# EAGLE design FONA-Data-Logger-Board (EAGLE 7.5.0)
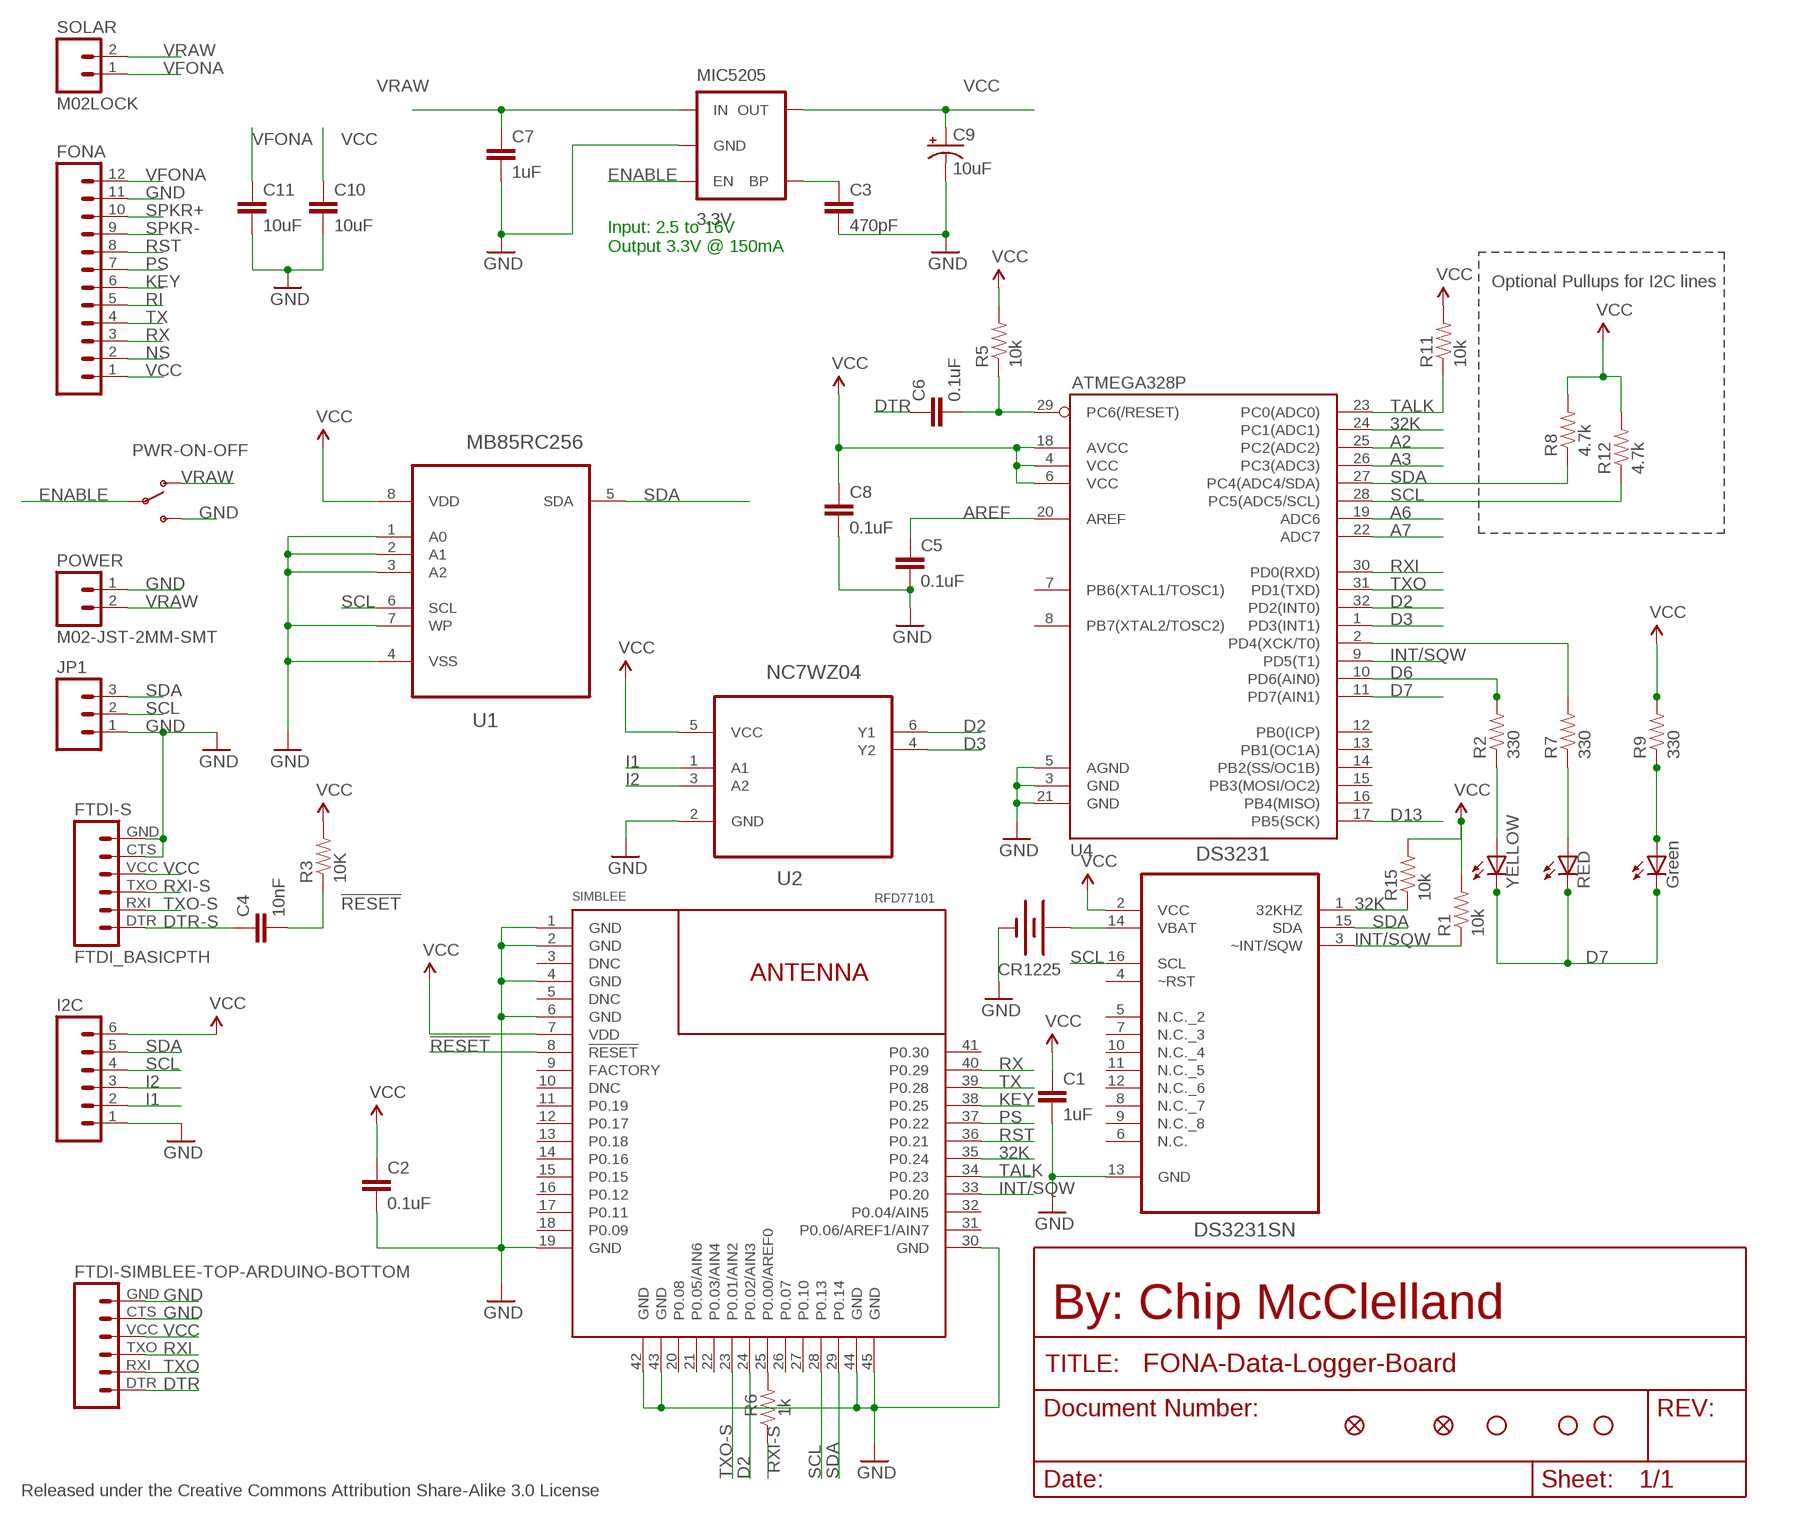
[diagram p0: schematic, sheet 1]

## Parts
ATMEGA328P  U4  ATMEGA168  [TQFP32-08]
C1  1uF  CAP0805  [0805]
C2  0.1uF  CAP0805  [0805]
C3  470pF  CAP0805  [0805]
C4  10nF  CAP0805  [0805]
C5  0.1uF  CAP0805  [0805]
C6  0.1uF  CAP0805  [0805]
C7  1uF  CAP0805  [0805]
C8  0.1uF  CAP0805  [0805]
C9  10uF  CAP_POL1206  [EIA3216]
C10  10uF  CAP0805  [0805]
C11  10uF  CAP0805  [0805]
CR1225  BATTERY12MM  [BATTCON_12MM]
DS3231  DS3231SN  [SOIC127P1032X265-16N]
FID1  FIDUCIALUFIDUCIAL  [MICRO-FIDUCIAL]
FID2  FIDUCIALUFIDUCIAL  [MICRO-FIDUCIAL]
FONA  M12PTH  [1X12]
FTDI-S  FTDI_BASICPTH  [FTDI_BASIC]
FTDI-SIMBLEE-TOP-ARDUINO-BOTTOM  FTDI Basic  FTDI_BASICPTH  [FTDI_BASIC]
G  Green  LEDCHIPLED_0805  [CHIPLED_0805]
I2C  M06LOCK  [1X06_LOCK]
JP1  M03LOCK  [1X03_LOCK]
JP3  STAND-OFF  [STAND-OFF]
JP4  STAND-OFF  [STAND-OFF]
JP6  STAND-OFF  [STAND-OFF]
MB85RC256  U1  MB85RC128PNF-G-JNE1  [SOIC127P600X175-8N]
MIC5205  3.3V  MIC52053.3V  [SOT23-5]
NC7WZ04  U2  NC7WZ04P6X  [SOT65P210X110-6N]
POWER  M02-JST-2MM-SMT  [JST-2-SMD]
PWR-ON-OFF  SWITCH-SPDTPTH  [SWITCH-SPDT]
R  RED  LEDCHIPLED_0805  [CHIPLED_0805]
R1  10k  RESISTOR0805-RES  [0805]
R2  330  RESISTOR0603  [0603-RES]
R3  10K  RESISTOR0805-RES  [0805]
R5  10k  RESISTOR0805-RES  [0805]
R6  1k  RESISTOR0805-RES  [0805]
R7  330  RESISTOR0603  [0603-RES]
R8  4.7k  RESISTOR0805-RES  [0805]
R9  330  RESISTOR0603  [0603-RES]
R11  10k  RESISTOR0805-RES  [0805]
R12  4.7k  RESISTOR0805-RES  [0805]
R15  10k  RESISTOR0805-RES  [0805]
SIMBLEE  RFD77101  [RFD77101]
SOLAR  M02LOCK  [1X02_LOCK]
Y  YELLOW  LEDCHIPLED_0805  [CHIPLED_0805]

## Nets
32K: ATMEGA328P.24(PC1(ADC1)) DS3231.1(32KHZ) R15.1 SIMBLEE.35(P0.24)
!RESET: C4.2 R3.1 SIMBLEE.8(!RESET!)
A2: ATMEGA328P.25(PC2(ADC2))
A3: ATMEGA328P.26(PC3(ADC3))
A6: ATMEGA328P.19(ADC6)
A7: ATMEGA328P.22(ADC7)
AREF: ATMEGA328P.20(AREF) C5.1
D2: ATMEGA328P.32(PD2(INT0)) NC7WZ04.6(Y1) SIMBLEE.24(P0.02/AIN3)
D3: ATMEGA328P.1(PD3(INT1)) NC7WZ04.4(Y2)
D6: ATMEGA328P.10(PD6(AIN0)) R2.2
D7: ATMEGA328P.11(PD7(AIN1)) G.C R.C Y.C
D13: ATMEGA328P.17(PB5(SCK))
DTR: C6.1 FTDI-SIMBLEE-TOP-ARDUINO-BOTTOM.DTR
DTR-S: C4.1 FTDI-S.DTR
ENABLE: MIC5205.3(EN) PWR-ON-OFF.2(P)
GND: ATMEGA328P.3(GND) ATMEGA328P.5(AGND) ATMEGA328P.21(GND) C1.2 C2.2 C3.2 C5.2 C7.2 C8.2 C9.C(-) C10.2 C11.2 CR1225.GND(-) DS3231.13(GND) FONA.11 FTDI-S.CTS FTDI-S.GND FTDI-SIMBLEE-TOP-ARDUINO-BOTTOM.CTS FTDI-SIMBLEE-TOP-ARDUINO-BOTTOM.GND I2C.1 JP1.1 MB85RC256.1(A0) MB85RC256.2(A1) MB85RC256.3(A2) MB85RC256.4(VSS) MB85RC256.7(WP) MIC5205.2(GND) NC7WZ04.2(GND) POWER.1 PWR-ON-OFF.3(S) SIMBLEE.1(GND) SIMBLEE.2(GND) SIMBLEE.4(GND) SIMBLEE.6(GND) SIMBLEE.19(GND) SIMBLEE.30(GND) SIMBLEE.42(GND) SIMBLEE.43(GND) SIMBLEE.44(GND) SIMBLEE.45(GND)
I1: I2C.2 NC7WZ04.1(A1)
I2: I2C.3 NC7WZ04.3(A2)
INT/SQW: ATMEGA328P.9(PD5(T1)) DS3231.3(~INT/SQW) R1.1 SIMBLEE.33(P0.20)
KEY: FONA.6 SIMBLEE.38(P0.25)
N$1: R2.1 Y.A
N$2: C3.1 MIC5205.4(BP)
N$3: ATMEGA328P.2(PD4(XCK/T0)) R7.2
N$4: R7.1 R.A
N$17: R6.2 SIMBLEE.25(P0.00/AREF0)
N$38: G.A R9.1
NS: FONA.2
PS: FONA.7 SIMBLEE.37(P0.22)
RESET: ATMEGA328P.29(PC6(/RESET)) C6.2 R5.1
RI: FONA.5
RST: FONA.8 SIMBLEE.36(P0.21)
RX: FONA.3 SIMBLEE.40(P0.29)
RXI: ATMEGA328P.30(PD0(RXD)) FTDI-SIMBLEE-TOP-ARDUINO-BOTTOM.TXO
RXI-S: FTDI-S.TXO R6.1
SCL: ATMEGA328P.28(PC5(ADC5/SCL)) DS3231.16(SCL) I2C.4 JP1.2 MB85RC256.6(SCL) R12.1 SIMBLEE.28(P0.13)
SDA: ATMEGA328P.27(PC4(ADC4/SDA)) DS3231.15(SDA) I2C.5 JP1.3 MB85RC256.5(SDA) R8.1 SIMBLEE.29(P0.14)
SPKR+: FONA.10
SPKR-: FONA.9
TALK: ATMEGA328P.23(PC0(ADC0)) R11.1 SIMBLEE.34(P0.23)
TX: FONA.4 SIMBLEE.39(P0.28)
TXO: ATMEGA328P.31(PD1(TXD)) FTDI-SIMBLEE-TOP-ARDUINO-BOTTOM.RXI
TXO-S: FTDI-S.RXI SIMBLEE.23(P0.01/AIN2)
VBAT: CR1225.PWR@1(+) DS3231.14(VBAT)
VCC: ATMEGA328P.4(VCC) ATMEGA328P.6(VCC) ATMEGA328P.18(AVCC) C1.1 C2.1 C8.1 C9.A(+) C10.1 DS3231.2(VCC) FONA.1 FTDI-S.VCC FTDI-SIMBLEE-TOP-ARDUINO-BOTTOM.VCC I2C.6 MB85RC256.8(VDD) MIC5205.5(OUT) NC7WZ04.5(VCC) R1.2 R3.2 R5.2 R8.2 R9.2 R11.2 R12.2 R15.2 SIMBLEE.7(VDD)
VFONA: C11.1 FONA.12 SOLAR.1
VRAW: C7.1 MIC5205.1(IN) POWER.2 PWR-ON-OFF.1(O) SOLAR.2
Unconnected: ATMEGA328P.7(PB6(XTAL1/TOSC1)) ATMEGA328P.8(PB7(XTAL2/TOSC2)) ATMEGA328P.12(PB0(ICP)) ATMEGA328P.13(PB1(OC1A)) ATMEGA328P.14(PB2(SS/OC1B)) ATMEGA328P.15(PB3(MOSI/OC2)) ATMEGA328P.16(PB4(MISO)) DS3231.4(~RST) DS3231.5(N.C._2) DS3231.6(N.C.) DS3231.7(N.C._3) DS3231.8(N.C._7) DS3231.9(N.C._8) DS3231.10(N.C._4) DS3231.11(N.C._5) DS3231.12(N.C._6) SIMBLEE.3(DNC) SIMBLEE.5(DNC) SIMBLEE.9(FACTORY) SIMBLEE.10(DNC) SIMBLEE.11(P0.19) SIMBLEE.12(P0.17) SIMBLEE.13(P0.18) SIMBLEE.14(P0.16) SIMBLEE.15(P0.15) SIMBLEE.16(P0.12) SIMBLEE.17(P0.11) SIMBLEE.18(P0.09) SIMBLEE.20(P0.08) SIMBLEE.21(P0.05/AIN6) SIMBLEE.22(P0.03/AIN4) SIMBLEE.26(P0.07) SIMBLEE.27(P0.10) SIMBLEE.31(P0.06/AREF1/AIN7) SIMBLEE.32(P0.04/AIN5) SIMBLEE.41(P0.30)

## Notes on the sheet
- Input: 2.5 to 16V
  Output 3.3V @ 150mA
- Optional Pullups for I2C lines
- By: Chip McClelland
- Released under the Creative Commons Attribution Share-Alike 3.0 License

## Library data of the parts
ATMEGA328P = SparkFun:ATMEGA168
C1 C2 C5 C6 C8 C10 C11 = SparkFun-Capacitors:CAP: Capacitor Standard 0603 ceramic capacitor, and 0.1" leaded capacitor.
C3 C4 C7 = SparkFun-Passives:CAP: Capacitor Standard 0603 ceramic capacitor, and 0.1" leaded capacitor.
C9 = SparkFun-Capacitors:CAP_POL: Capacitor Polarized These are standard SMD and PTH capacitors. Normally 10uF, 47uF, and 100uF in electrolytic and tantalum varieties. Always verify the external diameter of the through hole cap, it varies with capacity, voltage, and manufacturer. The EIA devices should be standard.
CR1225 = SparkFun-Electromechanical:BATTERY: Battery Holders Various common sizes : AA, AAA, 20mm coin cell and 12mm coin cell. 20MM_4LEGS, BATT-10373
DS3231 = Maxim_By_element14_Batch_1:DS3231SN: Extremely Accurate I2C-Integrated RTC/TCXO/Crystal; MPN: DS3231SN#; OC_FARNELL: 1593292; OC_NEWARK: 68K3406; PACKAGE: SOIC-16; SUPPLIER: Maxim
FID1 FID2 = SparkFun-Aesthetics:FIDUCIAL: Fiducial Alignment Points Various fiducial points for machine vision alignment.
FONA = SparkFun-Connectors:M12: Header 12 Standard 12-pin 0.1" header. Use with straight break away headers (SKU : PRT-00116), right angle break away headers (PRT-00553), swiss pins (PRT-00743), machine pins (PRT-00117), and female headers (PRT-00115).
FTDI-S FTDI-SIMBLEE-TOP-ARDUINO-BOTTOM = SparkFun-Connectors:FTDI_BASIC: FTDI Basic header with labels
G R Y = adafruit:LED: LED OSRAM: - CHIPLED LG R971, LG N971, LY N971, LG Q971, LY Q971, LO R971, LY R971 LH N974, LH R974 LS Q976, LO Q976, LY Q976 LO Q996 - Hyper CHIPLED LW Q18S LB Q993, LB Q99A, LB R99A - SideLED LS A670, LO A670, LY A670, LG A670, LP A670 LB A673, LV A673, LT A673, LW A673 LH A674 LY A675 LS A676, LA A676, LO A676, LY A676, LW A676 LS A679, LY A679, LG A679 - Hyper Micro SIDELED® LS Y876, LA Y876, LO Y876, LY Y876 LT Y87S - SmartLED LW L88C, LW L88S LB L89C, LB L89S, LG L890 LS L89K, LO L89K, LY L89K LS L896, LA L896, LO L896, LY L896 - TOPLED LS T670, LO T670, LY T670, LG T670, LP T670 LSG T670, LSP T670, LSY T670, LOP T670, LYG T670 LG T671, LOG T671, LSG T671 LB T673, LV T673, LT T673, LW T673 LH T674 LS T676, LA T676, LO T676, LY T676, LB T676, LH T676, LSB T676, LW T676 LB T67C, LV T67C, LT T67C, LS T67K, LO T67K, LY T67K, LW E67C LS E67B, LA E67B, LO E67B, LY E67B, LB E67C, LV E67C, LT E67C LW T67C LS T679, LY T679, LG T679 LS T770, LO T770, LY T770, LG T770, LP T770 LB T773, LV T773, LT T773, LW T773 LH T774 LS E675, LA E675, LY E675, LS T675 LS T776, LA T776, LO T776, LY T776, LB T776 LHGB T686 LT T68C, LB T68C - Hyper Mini TOPLED® LB M676 - Mini TOPLED Santana® LG M470 LS M47K, LO M47K, LY M47K Source: http://www.osram.convergy.de/
I2C = SparkFun-Connectors:M06: Header 6 Standard 6-pin 0.1" header. Use with straight break away headers (SKU : PRT-00116), right angle break away headers (PRT-00553), swiss pins (PRT-00743), machine pins (PRT-00117), and female headers (PRT-00115). Molex polarized connector foot print use with SKU : PRT-08094 with associated crimp pins and housings. NOTES ON THE VARIANTS LOCK and LOCK_LONGPADS... This footprint was designed to help hold the alignment of a through-hole component (i.e. 6-pin header) while soldering it into place. You may notice that each hole has been shifted either up or down by 0.005 of an inch from it's more standard position (which is a perfectly straight line). This slight alteration caused the pins (the squares in the middle) to touch the edges of the holes. Because they are alternating, it causes a "brace" to hold the component in place. 0.005 has proven to be the perfect amount of "off-center" position when using our standard breakaway headers. Although looks a little odd when you look at the bare footprint, once you have a header in there, the alteration is very hard to notice. Also,if you push a header all the way into place, it is covered up entirely on the bottom side. This idea of altering the position of holes to aid alignment will be further integrated into the Sparkfun Library for other footprints. It can help hold any component with 3 or more connection pins.
JP1 = SparkFun-Connectors:M03: Header 3 Standard 3-pin 0.1" header. Use with straight break away headers (SKU : PRT-00116), right angle break away headers (PRT-00553), swiss pins (PRT-00743), machine pins (PRT-00117), and female headers (PRT-00115). Molex polarized connector foot print use with SKU : PRT-08232 with associated crimp pins and housings.
JP3 JP4 JP6 = SparkFun:STAND-OFF: Stand Off This is the mechanical footprint for a #4 phillips button head screw. Use the keepout ring to avoid running the screw head into surrounding components. SKU : PRT-00447
MB85RC256 = Fujitsu_By_element14_Batch_1:MB85RC128PNF-G-JNE1: Memory FRAM; MPN: MB85RC128PNF-G-JNE1; OC_FARNELL: 1831995; OC_NEWARK: 93R5161; PACKAGE: SO-8; SUPPLIER: FUJITSU
MIC5205 = SparkFun-PowerIC:MIC5205: MIC5205 150mA vreg 3.3V - VREG-00822 5V - VREG-00823; PROD_ID: VREG-00822
NC7WZ04 = Fairchild_By_element14_Batch_1:NC7WZ04P6X: UHS Dual Inverter; MPN: NC7WZ04P6X; OC_FARNELL: 1417665; OC_NEWARK: 58K1999; PACKAGE: SC-70-6; SUPPLIER: FAIRCHILD SEMICONDUCTOR
POWER = SparkFun-Connectors:M02: Standard 2-pin 0.1" header. Use with - straight break away headers ( PRT-00116) - right angle break away headers (PRT-00553) - swiss pins (PRT-00743) - machine pins (PRT-00117) - female headers (PRT-00115) Molex polarized connector foot print use with: PRT-08233 with associated crimp pins and housings. 2.54_SCREWTERM for use with PRT-10571. 3.5mm Screw Terminal footprints for PRT-08084 5mm Screw Terminal footprints for use with PRT-08433; PROD_ID: CONN-08352
PWR-ON-OFF = SparkFun-Electromechanical:SWITCH-SPDT: SPDT Switch Simple slide switch, Spark Fun Electronics SKU : COM-00102 DPDT SMT slide switch, AYZ0202, SWCH-08179
R1 R3 R5 R6 R11 R15 = SparkFun-Passives:RESISTOR: Resistor Basic schematic elements and footprints for 0603, 1206, and PTH resistors.
R2 R7-R9 R12 = SparkFun-Resistors:RESISTOR: Resistor Basic schematic elements and footprints for 0603, 1206, and PTH resistors.
SIMBLEE = RFDigital:RFD77101: Simblee ™ BLE Module RFD77101 © 2015 RF Digital Corporation www.RFDigital.com www.Simblee.com PATENTS PENDING 04.01.2015
SOLAR = SparkFun-Connectors:M02: Standard 2-pin 0.1" header. Use with - straight break away headers ( PRT-00116) - right angle break away headers (PRT-00553) - swiss pins (PRT-00743) - machine pins (PRT-00117) - female headers (PRT-00115) Molex polarized connector foot print use with: PRT-08233 with associated crimp pins and housings. 2.54_SCREWTERM for use with PRT-10571. 3.5mm Screw Terminal footprints for PRT-08084 5mm Screw Terminal footprints for use with PRT-08433

## Net classes
0 default: width 0.203 mm
1 vcc: width 0.254 mm

## Board
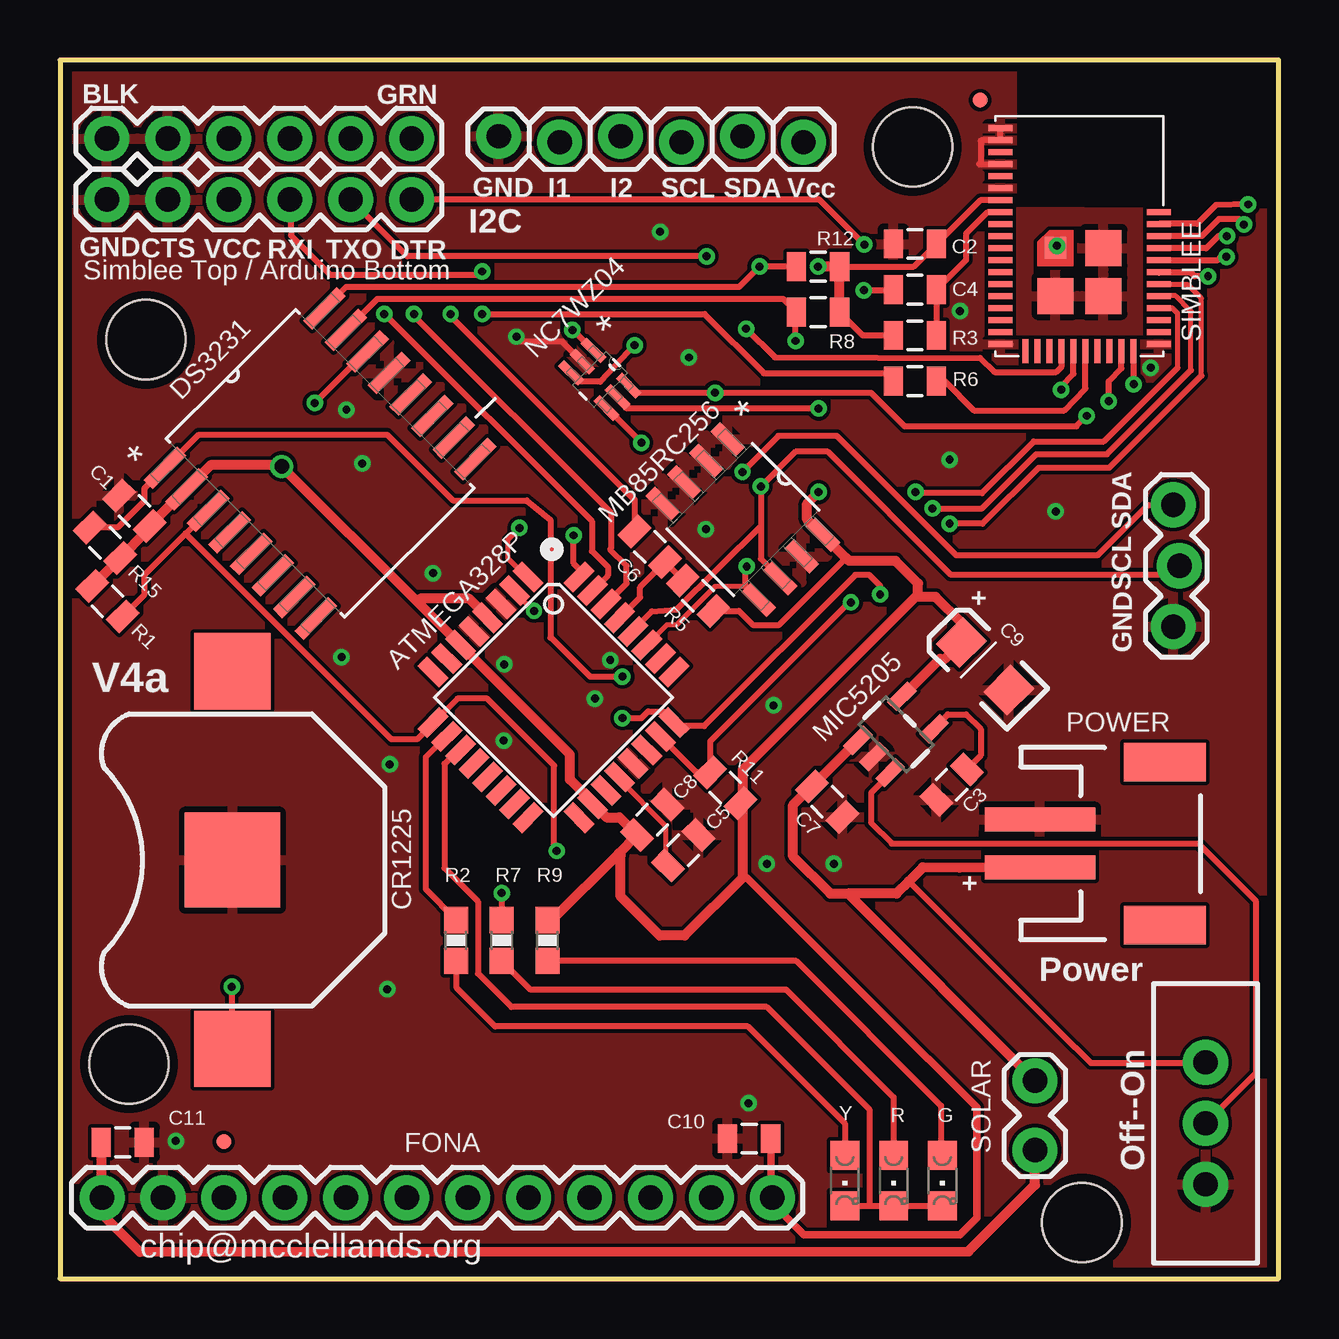
[diagram p1: board, top side]
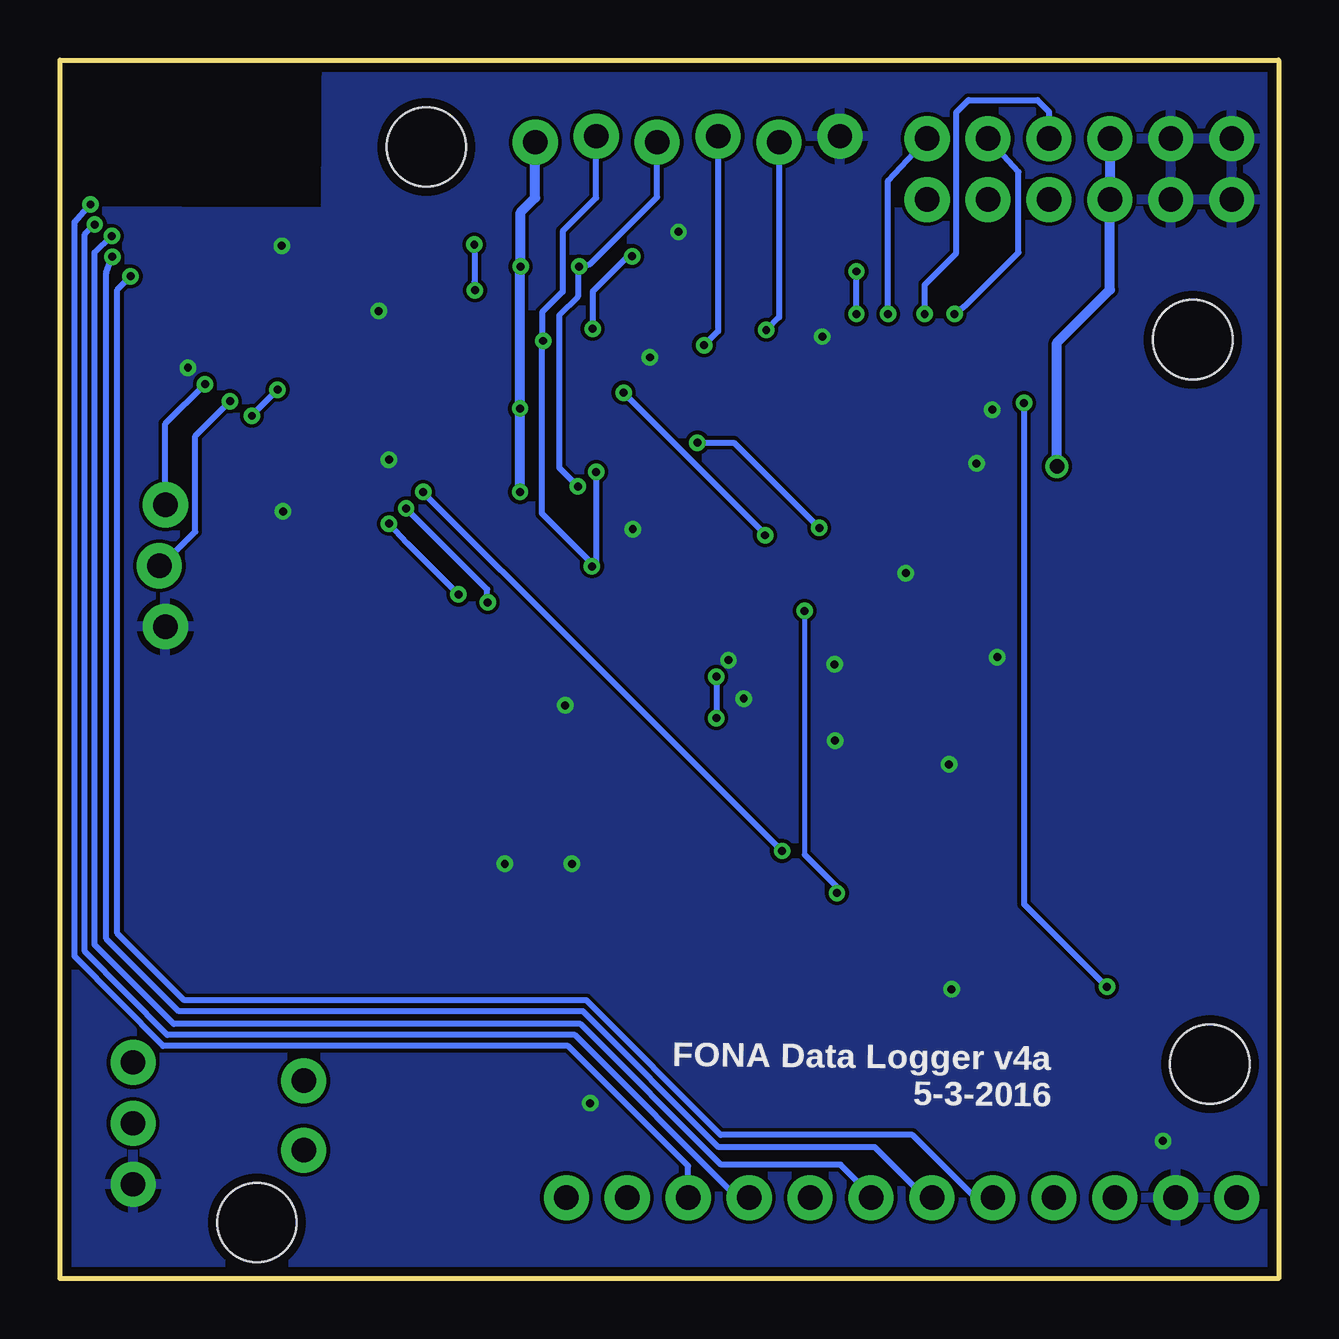
[diagram p2: board, bottom side, seen from below]

Size 50.8 x 50.8 mm. Coordinates in mm from the lower left corner, seen from the top.
Outline: 0,50.8 0,0 50.8,0 50.8,50.8 0,50.8
Copper layers (1*16): Top 0.0356mm / dielectric 1.5011mm / Bottom 0.0356mm
Design rules "LaenPCBOrder": minimum track width 6mil, minimum drill 13mil, track to track 6mil, track to pad 6mil, pad to pad 6mil, via to via 6mil, smd to smd 6mil, copper to edge 15mil, drill to drill 6mil, minimum pad ring 7mil, minimum via ring 7mil, stop-mask expansion 3mil, vias tented up to drill 0mil, thermal gap 10mil

### Footprints (pad centres in the part's own frame; a part is rotated, then mirrored left to right if it is on the bottom)
TQFP32-08 = smd 1.27 x 0.559: 1 -4.293,2.8; 2 -4.293,2; 3 -4.293,1.2; 4 -4.293,0.4; 5 -4.293,-0.4; 6 -4.293,-1.2; 7 -4.293,-2; 8 -4.293,-2.8; 17 4.293,-2.8; 18 4.293,-2; 19 4.293,-1.2; 20 4.293,-0.4; 21 4.293,0.4; 22 4.293,1.2; 23 4.293,2; 24 4.293,2.8 | smd 0.559 x 1.27: 9 -2.8,-4.293; 10 -2,-4.293; 11 -1.2,-4.293; 12 -0.4,-4.293; 13 0.4,-4.293; 14 1.2,-4.293; 15 2,-4.293; 16 2.8,-4.293; 25 2.8,4.293; 26 2,4.293; 27 1.2,4.293; 28 0.4,4.293; 29 -0.4,4.293; 30 -1.2,4.293; 31 -2,4.293; 32 -2.8,4.293
0805 = smd 0.8 x 1.2: 1 -0.9,0; 2 0.9,0
EIA3216 = smd 1.4 x 1.6: A 1.4,0; C -1.4,0
BATTCON_12MM = smd 3.962 x 3.962: GND 0,0 | smd 3.175 x 3.175: PWR@1 -7.874,0; PWR@2 7.874,0
SOIC127P1032X265-16N = smd 1.981 x 0.533: 1 -4.699,4.445; 2 -4.699,3.175; 3 -4.699,1.905; 4 -4.699,0.635; 5 -4.699,-0.635; 6 -4.699,-1.905; 7 -4.699,-3.175; 8 -4.699,-4.445; 9 4.699,-4.445; 10 4.699,-3.175; 11 4.699,-1.905; 12 4.699,-0.635; 13 4.699,0.635; 14 4.699,1.905; 15 4.699,3.175; 16 4.699,4.445
MICRO-FIDUCIAL = smd 0.635 x 0.635: 1 0,0
1X12 = drill 1.016 pad 1.88: 1 0,0; 2 2.54,0; 3 5.08,0; 4 7.62,0; 5 10.16,0; 6 12.7,0; 7 15.24,0; 8 17.78,0; 9 20.32,0; 10 22.86,0; 11 25.4,0; 12 27.94,0
FTDI_BASIC = drill 1.016 pad 1.88: CTS 10.16,0; DTR 0,0; GND 12.7,0; RXI 2.54,0; TXO 5.08,0; VCC 7.62,0
CHIPLED_0805 = smd 1.2 x 1.2: A 0,-1.05; C 0,1.05
1X06_LOCK = drill 1.016 pad 1.88: 1 0,0; 2 2.54,-0.254; 3 5.08,0; 4 7.62,-0.254; 5 10.16,0; 6 12.7,-0.254
1X03_LOCK = drill 1.016 pad 1.88: 1 0,0.127; 2 2.54,-0.127; 3 5.08,0.127
STAND-OFF = hole 3.302: 0,0
SOIC127P600X175-8N = smd 1.473 x 0.559: 1 -2.819,1.905; 2 -2.819,0.635; 3 -2.819,-0.635; 4 -2.819,-1.905; 5 2.819,-1.905; 6 2.819,-0.635; 7 2.819,0.635; 8 2.819,1.905
SOT23-5 = smd 0.55 x 1.2: 1 -0.95,-1.3; 2 0,-1.3; 3 0.95,-1.3; 4 0.95,1.3; 5 -0.95,1.3
SOT65P210X110-6N = smd 1.168 x 0.356: 1 -1.041,0.66; 2 -1.041,0; 3 -1.041,-0.66; 4 1.041,-0.66; 5 1.041,0; 6 1.041,0.66
JST-2-SMD = smd 1 x 4.6: 1 -1,-3.7; 2 1,-3.7 | smd 1.6 x 3.4: NC1 -3.4,1.5; NC2 3.4,1.5
SWITCH-SPDT = drill 1.016 pad 1.88: 1 0,2.54; 2 0,0; 3 0,-2.54
0603-RES = smd 1.1 x 1: 1 -0.85,0; 2 0.85,0
RFD77101 = smd 1 x 0.254: 1 0,0; 2 0,-0.5; 3 0,-1; 4 0,-1.5; 5 0,-2; 6 0,-2.5; 7 0,-3; 8 0,-3.5; 9 0,-4; 10 0,-4.5; 11 0,-5; 12 0,-5.5; 13 0,-6; 14 0,-6.5; 15 0,-7; 16 0,-7.5; 17 0,-8; 18 0,-8.5; 19 0,-9; 30 6.61,-9; 31 6.61,-8.5; 32 6.61,-8; 33 6.61,-7.5; 34 6.61,-7; 35 6.61,-6.5; 36 6.61,-6; 37 6.61,-5.5; 38 6.61,-5; 39 6.61,-4.5; 40 6.61,-4; 41 6.61,-3.5 | smd 0.254 x 1: 20 1.055,-9.29; 21 1.555,-9.29; 22 2.055,-9.29; 23 2.555,-9.29; 24 3.055,-9.29; 25 3.555,-9.29; 26 4.055,-9.29; 27 4.555,-9.29; 28 5.055,-9.29; 29 5.555,-9.29 | smd 0.9 x 0.9: 42 2.3,-4.99 | smd 1.5 x 1.5: 43 2.3,-6.99; 44 4.3,-6.99; 45 4.3,-4.99
1X02_LOCK = drill 1.016 pad 1.88: 1 -0.178,0; 2 2.718,0

### Placement (x,y rotation side)
ATMEGA328P  20.57,24.23 315 top
C1  3.1,32 135 top
C2  35.64,43.13 180 top
C3  37.16,20.6 225 top
C4  35.64,41.22 0 top
C5  25.98,17.86 45 top
C6  24.59,30.51 315 top
C7  31.98,19.89 315 top
C8  24.69,19.13 45 top
C9  38.56,25.53 135 top
C10  28.73,5.84 180 top
C11  2.62,5.69 0 top
CR1225  7.19,17.45 90 top
DS3231  10.85,33.99 45 top
FID1  6.83,5.71 0 top
FID2  38.35,49.12 0 top
FONA  29.69,3.38 180 top
FTDI-S  14.66,44.98 180 top
FTDI-SIMBLEE-TOP-ARDUINO-BOTTOM  14.66,47.52 180 top
G  36.78,4.09 180 top
I2C  18.29,47.62 0 top
JP1  46.53,27.18 90 top
JP2  STAND-OFF  [STAND-OFF]  3.58,39.14 0 top
JP3  2.87,8.94 0 top
JP4  42.6,2.34 0 top
JP6  35.53,47.17 0 top
MB85RC256  28.47,31.65 315 top
MIC5205  34.85,22.68 315 top
NC7WZ04  22.5,37.49 315 top
POWER  44.55,18.14 270 top
PWR-ON-OFF  47.75,6.48 0 top
R  34.75,4.09 180 top
R1  1.98,28.24 135 top
R2  16.51,14.1 90 top
R3  35.64,39.32 180 top
R5  26.59,28.47 315 top
R6  35.64,37.41 0 top
R7  18.41,14.1 90 top
R8  31.6,40.28 0 top
R9  20.32,14.1 90 top
R11  27.74,20.47 315 top
R12  31.6,42.19 0 top
R15  1.88,30.68 315 top
SIMBLEE  39.19,47.96 0 top
SOLAR  40.64,5.54 90 top
Y  32.72,4.09 180 top

### Tracks (layer width: path | path; a pad name or v marks a point on that pad's centre or on a via)
32K  (via drill 0.33)
  Top 0.203: 45.77,41.45 SIMBLEE.35 45.83,41.43 47.02,41.43 47.57,40.87 47.57,37.64
  Top 0.254: v37.08,31.47 38.46,31.47 40.79,33.81 43.74,33.81 47.57,37.64 | v34.19,28.52 34.19,28.88 33.73,29.34 33.15,29.34 26.85,23.04 25.73,23.04 ATMEGA328P.24 25.12,23.65 24.51,23.65 24.23,23.37 v23.44,23.37 | 1.04,31.09 R15.1 2.41,31.32 3.53,32.44 3.53,32.96 DS3231.1 4.42,33.81 5.79,35.18 13.64,35.18 16.38,32.44 19.46,32.44 20.45,31.62 20.45,26.72 20.47,26.72 22.1,25.09 v23.44,25.09
  Bottom 0.254: v37.08,31.47 36.32,30.66 v34.19,28.52 | v23.44,25.09 v23.44,23.37
!RESET
  Top 0.254: SIMBLEE.8 38.66,44.45 37.77,43.56 37.77,42.46 C4.2 R3.1
AREF
  Top 0.203: C5.1 25.25,17.27 25.25,18.87 23.29,20.83 ATMEGA328P.20
D2  (via drill 0.33)
  Top 0.254: v42.8,35.97 42.37,35.53 35.2,35.53 33.81,36.93 v27.3,36.93 24,36.93 NC7WZ04.6 | v41.73,37.06 41.73,37.21 42.24,37.72 42.24,38.66 SIMBLEE.24 | ATMEGA328P.32 21.63,29.27 21.92,29.57 21.67,29.57 21.41,29.82 v21.41,30.99
  Bottom 0.254: v42.8,35.97 42.8,35.99 v41.73,37.06 | v21.41,30.99 21.41,31.04 v27.3,36.93
D3  (via drill 0.33)
  Top 0.203: ATMEGA328P.1 19.45,29.25 18.67,30.02 18.67,30.81 v19.15,31.29
  Top 0.254: NC7WZ04.4 22.79,36.29 v24.23,34.85
  Bottom 0.254: v24.23,34.85 22.71,34.85 v19.15,31.29
D6
  Top 0.254: ATMEGA328P.10 16.11,22.61 15.24,21.74 15.24,16.24 R2.2
D7
  Top 0.254: G.C R.C Y.C 32.73,3.02 33.71,3.02 33.73,3.05 33.73,7.06 29.46,11.33 18.82,11.33 17.42,12.72 17.42,15.72 16.03,17.12 16.03,21.46 16.61,22.05 ATMEGA328P.11
DTR  (via drill 0.33)
  Top 0.254: v16.28,40.21 16.28,40.13 23.95,32.46 C6.1
  Bottom 0.254: v16.28,40.21 16.28,45.77 FTDI-SIMBLEE-TOP-ARDUINO-BOTTOM.DTR
DTR-S  (via drill 0.33)
  Top 0.254: v33.5,41.2 34.71,41.2 C4.1 | FTDI-S.DTR 31.65,44.98 v33.53,43.1
  Bottom 0.254: v33.53,43.1 33.53,41.55 v33.5,41.2
ENABLE
  Top 0.254: MIC5205.3 34.6,21.04 33.81,20.24 33.81,19 34.67,18.14 47.45,18.14 49.86,15.72 49.86,8.59 PWR-ON-OFF.2
GND  (via drill 0.33)
  Top 0.254: SIMBLEE.1 SIMBLEE.2 38.41,47.45 38.38,47.42 38.38,46.53 38.3,46.46 SIMBLEE.4 | SIMBLEE.44 | SIMBLEE.19 39.62,38.95 | 41.48,40.95 SIMBLEE.43 | NC7WZ04.2 20.93,39.06 19.23,39.06 v19.02,39.27
  other vias: 11.73,25.91 15.54,29.41 12.6,33.99 29.46,17.3 18.52,25.6 18.49,22.43 22.3,24.18 22.94,25.78 29.74,23.9 32.26,17.3 45.47,37.97 26.92,31.24 37.52,40.34 41.55,43.05 13.74,21.44 41.5,31.98 37.08,34.14 26.21,38.4 11.94,36.22 13.64,12.06 4.83,5.74 28.7,7.32 25.02,43.64
  pour Bottom: -1.24,52.22 -1.4,45.44 -1.22,-4.7 51.54,-4.85 51.54,35.59 51.82,35.66 51.74,44.53 39.7,44.48 39.67,52.02
  pour Top: -1.22,52.22 -1.55,-4.65 51.54,-4.72 51.71,44.4 39.7,44.48 39.7,52.07
I1  (via drill 0.33)
  Top 0.254: v21.36,39.55 21.38,39.55 NC7WZ04.1
  Bottom 0.254: I2C.2 20.83,40.08 v21.36,39.55
I2  (via drill 0.33)
  Top 0.254: v23.95,38.91 22.53,37.39 21.57,37.39 NC7WZ04.3
  Bottom 0.254: I2C.3 23.37,39.5 v23.95,38.91
INT/SQW  (via drill 0.33, 0.33 pad 0.25)
  Top 0.203: 15.47,23.32 ATMEGA328P.9 | 46.58,37.97 46.58,40.23 46.35,40.46 SIMBLEE.33
  Top 0.254: ATMEGA328P.9 16.56,24.18 17.8,24.18 20.6,21.39 20.6,17.83 v20.7,17.83 | 46.58,37.97 43.51,34.9 40.59,34.9 38.43,32.74 35.71,32.74 v35.66,32.79 | 5.23,31.07 3.5,29.34 3.5,28.5 R1.1 | 5.23,31.07 DS3231.3 | 15.47,23.32 15.47,23.06 14.88,22.48 13.82,22.48 5.23,31.07
  Bottom 0.254: v35.66,32.79 35.59,32.69 29.21,26.34 v20.7,17.83
KEY  (via drill 0.33)
  Top 0.254: v48.64,43.46 48.28,43.46 47.78,42.95 SIMBLEE.38
  Bottom 0.254: FONA.6 16.99,3.48 18.26,4.75 23.24,4.75 29.11,10.62 46.05,10.62 49.35,13.92 49.35,42.77 v48.64,43.46
N$1
  Top 0.254: R2.1 16.54,12.12 18.14,10.52 28.68,10.52 32.72,6.48 Y.A
N$2
  Top 0.254: MIC5205.4 36.44,22.95 37.01,23.52 37.77,23.52 38.38,22.91 38.38,21.82 C3.1
N$3  (via drill 0.33)
  Top 0.203: v19.76,27.84 19.02,28.55 ATMEGA328P.2
  Top 0.254: v18.41,16.08 R7.2
  Bottom 0.203: v19.76,27.84 19.76,17.68
  Bottom 0.254: v18.41,16.08 18.41,16.33 19.76,17.68
N$4
  Top 0.254: R.A 34.75,7.57 30.28,12.04 19.62,12.04 R7.1 18.41,12.95
N$17
  Top 0.254: R6.2 36.88,37.41 38.1,36.2 41.86,36.2 42.75,37.11 42.75,38.64 SIMBLEE.25
N$38
  Top 0.254: G.A 36.73,5.19 36.73,7.21 30.7,13.25 R9.1
PS  (via drill 0.33)
  Top 0.254: v48.62,42.6 48.39,42.6 48.23,42.44 45.81,42.44 SIMBLEE.37
  Bottom 0.254: FONA.7 14.73,3.38 16.84,5.49 23.34,5.49 29.01,11.15 45.85,11.15 48.87,14.17 48.87,41.94 v48.62,42.6
RESET
  Top 0.254: ATMEGA328P.29 24.18,28.4 24.18,28.83 C6.2 25.91,29.18 | R5.1 25.96,29.14 25.91,29.18 | 25.91,29.18
RST  (via drill 0.33)
  Top 0.254: v47.85,41.78 47.3,41.78 47.14,41.94 45.82,41.94 SIMBLEE.36
  Bottom 0.254: FONA.8 12.65,3.38 15.27,5.99 23.27,5.99 28.85,11.61 45.62,11.61 48.41,14.4 48.41,41.22 v47.85,41.78
RX  (via drill 0.33)
  Top 0.254: v49.53,44.78 48.18,44.76 47.4,43.97 45.81,43.97 SIMBLEE.40
  Bottom 0.254: FONA.3 24.61,4.7 29.62,9.7 46.51,9.7 50.19,13.44 50.19,44.04 v49.53,44.78
RXI  (via drill 0.33)
  Top 0.203: ATMEGA328P.30 22.76,28.01
  Top 0.254: ATMEGA328P.30 23.62,28.98 23.62,29.72 22.94,30.4 22.96,30.43 22.96,31.93 14.76,40.13 v14.76,40.21
  Bottom 0.254: v14.76,40.21 14.76,41.43 13.44,42.75 13.44,48.62 12.93,49.12 10.06,49.12 9.58,48.64 FTDI-SIMBLEE-TOP-ARDUINO-BOTTOM.TXO
RXI-S  (via drill 0.33)
  Top 0.254: v17.6,40.21 26.87,40.21 29.34,37.74 34.41,37.74 R6.1 | v17.6,41.99 17.48,41.86 11.25,41.86 9.63,43.48 FTDI-S.TXO
  Bottom 0.254: v17.6,40.21 v17.6,41.99
SCL  (via drill 0.33)
  Top 0.254: R12.1 v29.16,42.19 28.32,41.35 11.94,41.35 DS3231.16 | ATMEGA328P.28 23.96,26.98 23.96,27.11 24.66,27.81 25.7,27.89 29.21,31.37 | 29.21,31.37 v29.21,33.02 30.66,34.47 32,34.47 37.11,29.36 46.3,29.36 JP1.2 | 29.21,31.37 29.21,30.01 MB85RC256.6 | v43.71,36.58 43.71,37.41 44.25,37.95 SIMBLEE.28 | SIMBLEE.28
  Bottom 0.254: I2C.4 25.91,45.09 28.7,42.29 v29.16,42.19 29.21,42.14 29.21,40.95 30,40.16 30,33.81 v29.21,33.02 | JP1.2 46.58,29.72 45.16,31.14 45.16,35.13 v43.71,36.58
SDA  (via drill 0.33)
  Top 0.203: 28.57,28.85 27.3,28.85 25.7,27.25 25.29,27.25 ATMEGA328P.27
  Top 0.254: R8.1 30.66,40.06 | ATMEGA328P.27 | MB85RC256.5 28.57,28.85 28.57,29.64 v28.63,29.69 | DS3231.15 13.23,40.84 30.14,40.84 R8.1 | v44.76,37.29 44.76,38.66 SIMBLEE.29 | JP1.3 45.34,32.26 43.23,30.15 37.36,30.15 32.38,35.13 29.95,35.13 v28.45,33.63 | v30.66,39.09 30.66,40.24 R8.1
  Bottom 0.254: I2C.5 28.45,45.06 29.84,43.66 29.84,41.14 R8.1 30.7,39.13 v30.66,39.09 30.71,39.04 30.71,31.9 28.63,29.82 v28.63,29.69 28.45,29.87 v28.45,33.63 | JP1.3 46.41,35.64 v44.76,37.29
TALK  (via drill 0.33)
  Top 0.203: 45.79,40.97 SIMBLEE.34 45.82,40.97 46.51,40.97 47.14,40.34 47.14,37.87
  Top 0.254: v36.37,32.11 38.43,32.11 40.69,34.37 43.64,34.37 47.14,37.87 | v32.97,28.19 32.89,28.19 27.1,22.4 R11.1 26.52,21.11 ATMEGA328P.23
  Bottom 0.203: 36.45,32.11 v36.37,32.11
  Bottom 0.254: v32.97,28.19 32.99,28.19 32.99,28.73 v36.37,32.11
TX  (via drill 0.33)
  Top 0.254: v49.35,43.94 49.15,44.17 48.31,44.17 47.6,43.46 SIMBLEE.39
  Bottom 0.254: FONA.4 22.55,3.38 29.34,10.16 46.33,10.16 49.76,13.64 49.76,43.54 v49.35,43.94
TXO  (via drill 0.33)
  Top 0.254: 22.2,28.7 ATMEGA328P.31 22.84,29.32 22.84,29.67 22.17,30.33 22.17,31.57 13.54,40.21 v13.51,40.21
  Bottom 0.254: v13.51,40.21 13.03,40.59 10.85,42.77 10.85,46.13 FTDI-SIMBLEE-TOP-ARDUINO-BOTTOM.RXI
TXO-S  (via drill 0.33)
  Top 0.254: v28.6,39.6 29.79,38.41 38.35,38.38 38.94,37.8 41.53,37.8 41.76,38.02 41.76,38.66 SIMBLEE.23 | v26.95,42.62 14.48,42.62 FTDI-S.RXI
  Bottom 0.254: v26.95,42.62 27.13,42.62 28.6,41.15 v28.6,39.6
VBAT  (via drill 0.33)
  Top 0.254: DS3231.14 12.82,38.6 12.72,38.6 v10.62,36.5 | v7.16,12.17 7.16,9.6 CR1225.PWR@1
  Bottom 0.254: v10.62,36.5 10.62,15.62 v7.16,12.17
VCC  (via drill 0.33, 0.6)
  Top 0.254: R11.2 28.37,20.09 28.45,20.17 | v31.62,36.27 23.62,36.27 NC7WZ04.5 | SIMBLEE.7 38.36,44.95 C2.1 35.59,42.19 32.51,42.19 | R3.2 33.46,39.32 R8.2 | R5.2 28.3,27.84 28.88,27.25 29.97,27.25 32.77,30.05
  Top 0.305: C10.1 29.63,3.44 FONA.1 29.69,3.15 31.01,1.83 37.52,1.83 38.23,2.54 38.23,7.14 36.2,9.17 36.17,9.17 28.63,16.71 28.45,16.71
  Top 0.406: v9.25,33.86 9.2,33.91 9.07,33.91 | v9.25,33.86 14.89,28.22 | 14.89,28.22 ATMEGA328P.6 21.26,21.85 21.26,20.8 22.2,19.87 ATMEGA328P.18 22.23,19.78 22.78,19.23 23.31,19.23 C8.1 | C8.1 24.05,18.31 | 9.07,33.91 6.28,33.91 DS3231.2 | DS3231.2 5.28,32.79 | v9.25,33.86 9.12,33.86 9.07,33.91 | DS3231.2 3.58,31.24 C1.1 3.58,31.19 3.58,31.11 R15.2 2.28,29.82 R1.2 | ATMEGA328P.4 17.82,27.57 17.04,28.35 15.01,28.35 14.89,28.22 | R8.2 R12.2 | 32.51,42.19 R12.2 | 35.66,28.42 28.45,21.21 28.45,20.17 28.45,16.71 26.04,14.3 24.99,14.3 23.37,15.93 23.37,17.65 23.29,17.73 | 35.66,28.42 35.76,28.52 35.76,28.98 34.82,29.92 32.9,29.92 32.77,30.05 MB85RC256.8 31.79,31 31.14,31.65 31.14,32.31 v31.62,32.79 | R12.2 v31.6,42.19 | MIC5205.5 35.12,24.27 36.68,25.83 36.88,25.83 C9.A 37.57,27.36 36.5,28.42 35.66,28.42 | 23.8,18.24 C8.1 | R9.2 20.51,14.95 23.29,17.73 | 23.29,17.73 C8.1
  Bottom 0.406: v9.25,33.86 9.25,39.01 7.04,41.22 FTDI-S.VCC FTDI-SIMBLEE-TOP-ARDUINO-BOTTOM.VCC | I2C.6 30.99,45.06 31.6,44.45 v31.6,42.19 31.62,42.16 v31.62,36.27 v31.62,32.79
VFONA
  Top 0.406: C11.1 1.72,3.42 FONA.12 1.75,2.69 3.33,1.12 37.87,1.14 40.64,3.91 SOLAR.1
VRAW
  Top 0.254: 35.99,17.12 35.97,17.14 | 35.38,16.56 42.32,9.63 42.34,9.63 42.98,8.99 47.73,8.99 PWR-ON-OFF.1
  Top 0.406: POWER.2 37.5,17.13 35.97,17.14 35.38,16.56 34.87,16.05 32.84,16.05 | MIC5205.1 C7.1 30.56,19.74 30.56,17.6 32.11,16.05 32.84,16.05 | 32.84,16.05 SOLAR.2

### Text on the board
tPlace: GRN | BLK | GND | I1 | I2 | SCL | SDA | Vcc | GND | CTS | VCC | RXI | TXO | Simblee Top / Arduino Bottom | DTR | SDA | SCL | + | GND | + | Power | Off--On
tNames: V4a | chip@mcclellands.org
bNames: FONA Data Logger v4a / 5-3-2016
Name: V5a